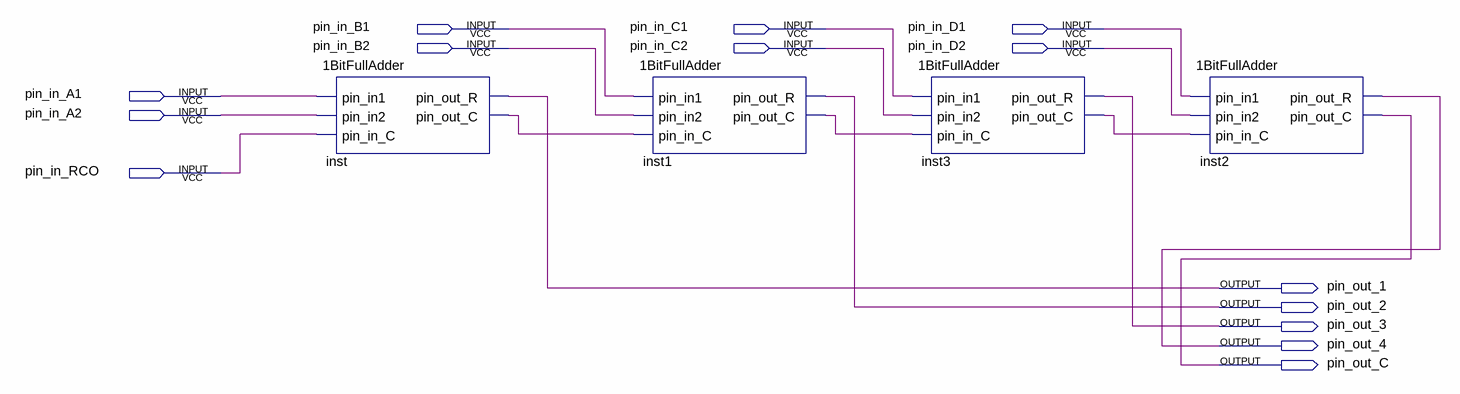
[diagram p0: schematic sheet]
// Quartus schematic 4BitFullAdder.bdf as structural Verilog: 4 symbols, 14 pins
module \4BitFullAdder  (
  input  pin_in_B1,
  input  pin_in_C1,
  input  pin_in_D1,
  input  pin_in_B2,
  input  pin_in_C2,
  input  pin_in_D2,
  input  pin_in_A1,
  input  pin_in_A2,
  input  pin_in_RCO,
  output pin_out_1,
  output pin_out_2,
  output pin_out_3,
  output pin_out_4,
  output pin_out_C
);

  wire inst1_pin_out_c, inst3_pin_out_c, inst_pin_out_c;

  \1BitFullAdder  inst (
    .pin_in1(pin_in_A1), .pin_in2(pin_in_A2), .pin_in_C(pin_in_RCO), .pin_out_R(pin_out_1),
    .pin_out_C(inst_pin_out_c));
  \1BitFullAdder  inst1 (
    .pin_in1(pin_in_B1), .pin_in2(pin_in_B2), .pin_in_C(inst_pin_out_c), .pin_out_R(pin_out_2),
    .pin_out_C(inst1_pin_out_c));
  \1BitFullAdder  inst3 (
    .pin_in1(pin_in_C1), .pin_in2(pin_in_C2), .pin_in_C(inst1_pin_out_c), .pin_out_R(pin_out_3),
    .pin_out_C(inst3_pin_out_c));
  \1BitFullAdder  inst2 (
    .pin_in1(pin_in_D1), .pin_in2(pin_in_D2), .pin_in_C(inst3_pin_out_c), .pin_out_R(pin_out_4),
    .pin_out_C(pin_out_C));
endmodule
